# EAGLE schematic 4-up (EAGLE 9.5.2)
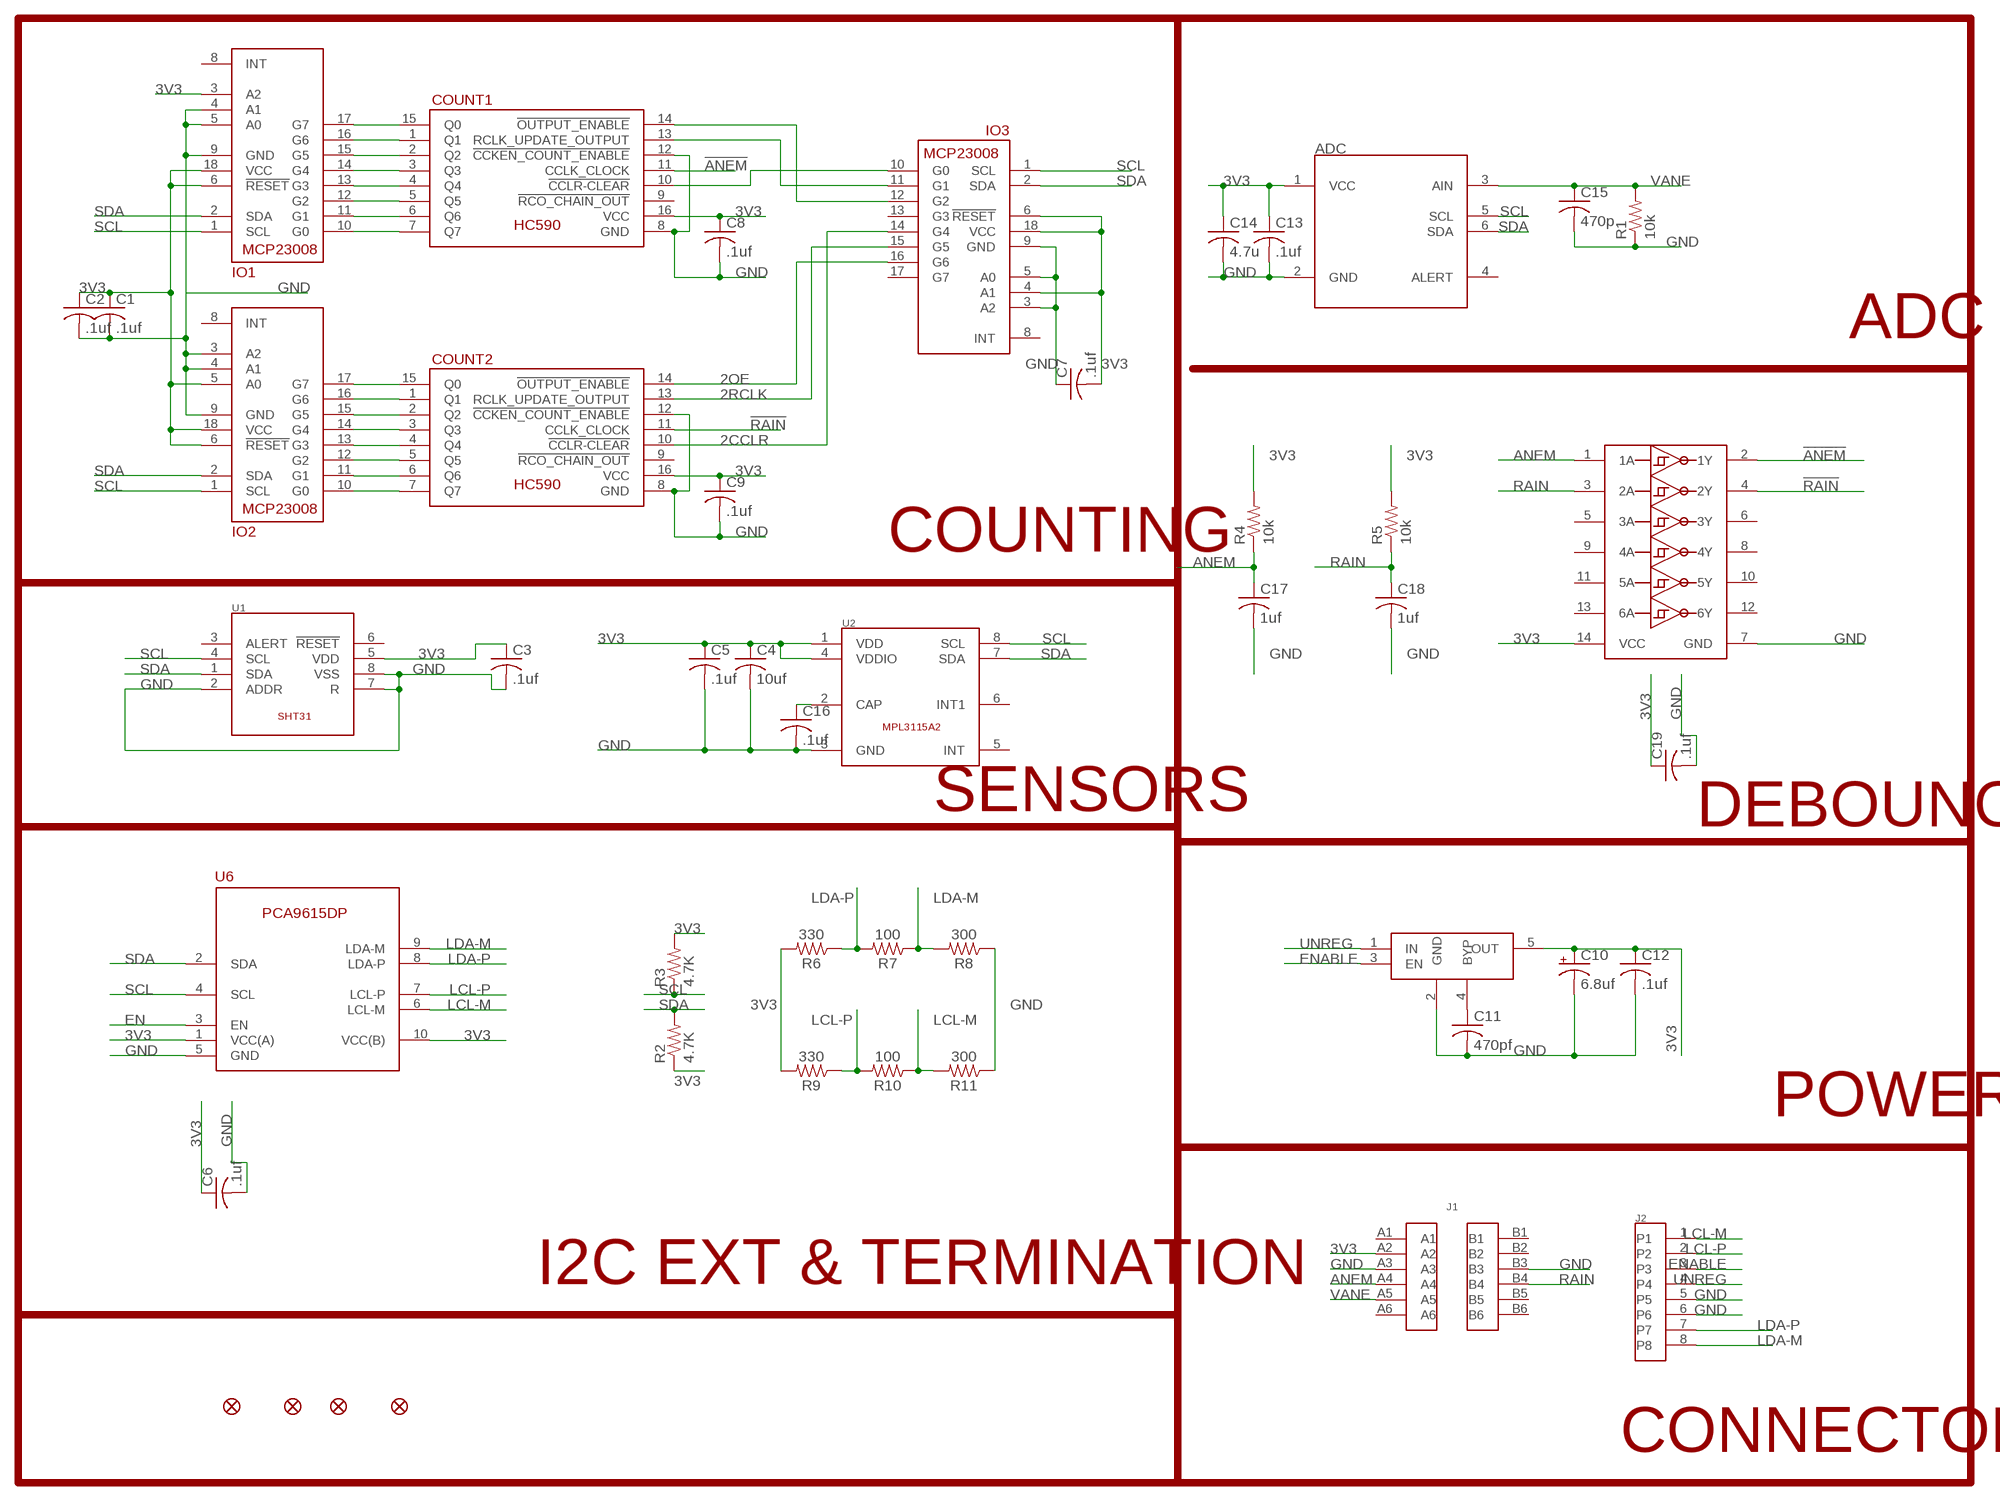
[diagram p0: schematic, sheet 1]

## Parts
ADC  ADC081C021SOT-DDC  [SOP95P280X110-6]
C1  .1uf  C-USC0603K  [C0603K]
C2  .1uf  C-USC0603K  [C0603K]
C3  .1uf  C-USC0603K  [C0603K]
C4  10uf  C-USC0603K  [C0603K]
C5  .1uf  C-USC0603K  [C0603K]
C6  .1uf  C-USC0603K  [C0603K]
C7  .1uf  C-USC0603K  [C0603K]
C8  .1uf  C-USC0603K  [C0603K]
C9  .1uf  C-USC0603K  [C0603K]
C10  6.8uf  CPOL-USA/3216-18R  [A/3216-18R]
C11  470pf  C-USC0603K  [C0603K]
C12  .1uf  C-USC0603K  [C0603K]
C13  .1uf  C-USC0603K  [C0603K]
C14  4.7u  C-USC0603K  [C0603K]
C15  470p  C-USC0603K  [C0603K]
C16  .1uf  C-USC0603K  [C0603K]
C17  1uf  C-USC0603K  [C0603K]
C18  1uf  C-USC0603K  [C0603K]
C19  .1uf  C-USC0603K  [C0603K]
COUNT1  74HC590  [SOIC127P1050X265-16]
COUNT2  74HC590  [SOIC127P1050X265-16]
FID1  FIDUCIAL1X2.5  [FIDUCIAL-1X2.5]
FID2  FIDUCIAL1X2.5  [FIDUCIAL-1X2.5]
FID3  FIDUCIAL1X2.5  [FIDUCIAL-1X2.5]
FID4  FIDUCIAL1X2.5  [FIDUCIAL-1X2.5]
INVERTER  74HC14  [SOIC127P780X200-14]
IO1  MCP23008  [SOIC18-W]
IO2  MCP23008  [SOIC18-W]
IO3  MCP23008  [SOIC18-W]
J1  43841-0005  [43841-0005]
J2  95501-6889  [95501-6889]
R1  10k  R-US_R0603  [R0603]
R2  4.7K  R-US_R0603  [R0603]
R3  4.7K  R-US_R0603  [R0603]
R4  10k  R-US_R0603  [R0603]
R5  10k  R-US_R0603  [R0603]
R6  330  100KOHM-0603-1/10W-1%  [0603]
R7  100  100KOHM-0603-1/10W-1%  [0603]
R8  300  100KOHM-0603-1/10W-1%  [0603]
R9  330  100KOHM-0603-1/10W-1%  [0603]
R10  100  100KOHM-0603-1/10W-1%  [0603]
R11  300  100KOHM-0603-1/10W-1%  [0603]
U1  SHT31  [SON50P240X240X80-9T80]
U2  MPL3115A2LGA8  [SON125P300X500X110-8]
U5  MIC5219-3.3YM5-TR  [SOT95P280X145-5]
U6  PCA9615  [SOP50P490X110-10]

## Nets
2CCLR: COUNT2.10(!CCLR-CLEAR) IO3.14(G4)
2OE: COUNT2.14(!OUTPUT_ENABLE) IO3.16(G6)
2RCLK: COUNT2.13(RCLK_UPDATE_OUTPUT) IO3.15(G5)
3V3: ADC.1(VCC) C1.1 C2.1 C3.1 C4.1 C5.1 C6.1 C7.2 C8.1 C9.1 C10.+ C12.1 C13.1 C14.1 C19.1 COUNT1.16(VCC) COUNT2.16(VCC) INVERTER.14(VCC) IO1.3(A2) IO1.6(!RESET) IO1.18(VCC) IO2.5(A0) IO2.6(!RESET) IO2.18(VCC) IO3.4(A1) IO3.6(!RESET) IO3.18(VCC) J1.A2 R2.1 R3.2 R4.2 R5.2 R6.2 R9.2 U1.5(VDD) U2.1(VDD) U2.4(VDDIO) U5.5(OUT) U6.1(VCC(A)) U6.10(VCC(B))
!ANEM: COUNT1.11(CCLK_CLOCK) INVERTER.2(1Y)
!RAIN: COUNT2.11(CCLK_CLOCK) INVERTER.4(2Y)
ANEM: C17.1 INVERTER.1(1A) J1.A4 R4.1
CAP: C16.1 U2.2(CAP)
EN: U6.3(EN)
ENABLE: J2.3 U5.3(EN)
GND: ADC.2(GND) C1.2 C2.2 C3.2 C4.2 C5.2 C6.2 C7.1 C8.2 C9.2 C10.- C11.2 C12.2 C13.2 C14.2 C15.2 C16.2 C17.2 C18.2 C19.2 COUNT1.8(GND) COUNT1.12(!CCKEN_COUNT_ENABLE) COUNT2.8(GND) COUNT2.12(!CCKEN_COUNT_ENABLE) INVERTER.7(GND) IO1.4(A1) IO1.5(A0) IO1.9(GND) IO2.3(A2) IO2.4(A1) IO2.9(GND) IO3.3(A2) IO3.5(A0) IO3.9(GND) J1.A3 J1.B3 J2.5 J2.6 R1.1 R8.1 R11.1 U1.2(ADDR) U1.7(R) U1.8(VSS) U2.3(GND) U5.2(GND) U6.5(GND)
LCL-M: J2.1 R10.1 R11.2 U6.6(LCL-M)
LCL-P: J2.2 R9.1 R10.2 U6.7(LCL-P)
LDA-M: J2.8 R7.1 R8.2 U6.9(LDA-M)
LDA-P: J2.7 R6.1 R7.2 U6.8(LDA-P)
N$1: COUNT2.15(Q0) IO2.17(G7)
N$2: COUNT2.1(Q1) IO2.16(G6)
N$3: COUNT2.2(Q2) IO2.15(G5)
N$4: COUNT2.3(Q3) IO2.14(G4)
N$5: COUNT2.4(Q4) IO2.13(G3)
N$6: COUNT2.5(Q5) IO2.12(G2)
N$7: COUNT2.6(Q6) IO2.11(G1)
N$8: COUNT2.7(Q7) IO2.10(G0)
N$9: COUNT1.15(Q0) IO1.17(G7)
N$10: COUNT1.1(Q1) IO1.16(G6)
N$12: COUNT1.2(Q2) IO1.15(G5)
N$13: COUNT1.3(Q3) IO1.14(G4)
N$14: COUNT1.4(Q4) IO1.13(G3)
N$15: COUNT1.5(Q5) IO1.12(G2)
N$16: COUNT1.6(Q6) IO1.11(G1)
N$17: COUNT1.7(Q7) IO1.10(G0)
N$18: COUNT1.14(!OUTPUT_ENABLE) IO3.12(G2)
N$19: COUNT1.13(RCLK_UPDATE_OUTPUT) IO3.11(G1)
N$20: COUNT1.10(!CCLR-CLEAR) IO3.10(G0)
N$23: C11.1 U5.4(BYP)
RAIN: C18.1 INVERTER.3(2A) J1.B4 R5.1
SCL: ADC.5(SCL) IO1.1(SCL) IO2.1(SCL) IO3.1(SCL) R3.1 U1.4(SCL) U2.8(SCL) U6.4(SCL)
SDA: ADC.6(SDA) IO1.2(SDA) IO2.2(SDA) IO3.2(SDA) R2.2 U1.1(SDA) U2.7(SDA) U6.2(SDA)
UNREG: J2.4 U5.1(IN)
VANE: ADC.3(AIN) C15.1 J1.A5 R1.2
Unconnected: ADC.4(ALERT) COUNT1.9(!RCO_CHAIN_OUT) COUNT2.9(!RCO_CHAIN_OUT) INVERTER.5(3A) INVERTER.6(3Y) INVERTER.8(4Y) INVERTER.9(4A) INVERTER.10(5Y) INVERTER.11(5A) INVERTER.12(6Y) INVERTER.13(6A) IO1.8(INT) IO2.8(INT) IO3.8(INT) IO3.13(G3) IO3.17(G7) J1.A1 J1.A6 J1.B1 J1.B2 J1.B5 J1.B6 U1.3(ALERT) U1.6(!RESET) U2.5(INT) U2.6(INT1)

## Notes on the sheet
- ADC
- COUNTING
- SENSORS | DEBOUNCE
- POWER
- I2C EXT & TERMINATION
- CONNECTORS

## Library data of the parts
ADC = Conservify:ADC081C021: 8-Bit ADC with Altert
C1-C9 C11-C19 = rcl:C-US: CAPACITOR, American symbol; SPICEPREFIX: C
C10 = rcl:CPOL-US: POLARIZED CAPACITOR, American symbol; SPICEPREFIX: C
COUNT1 COUNT2 = Conservify:74HC590
FID1-FID4 = microbuilder:FIDUCIAL: Fiducial Alignment Points Various fiducial points for machine vision alignment.; BOM: EXCLUDE
INVERTER = Conservify:74HC14
IO1-IO3 = Conservify:MCP23008
J1 = Conservify:43841-0005
J2 = Conservify:95501-6889: Molex RJ-45 Connector
R1-R5 = rcl:R-US_: RESISTOR, American symbol; SPICEPREFIX: R
R6-R11 = SparkFun-Resistors:100KOHM: 100kΩ resistor A resistor is a passive two-terminal electrical component that implements electrical resistance as a circuit element. Resistors act to reduce current flow, and, at the same time, act to lower voltage levels within circuits. - Wikipedia; PROD_ID: RES-07828; VALUE: 100k
U1 = Conservify:SHT31: SHT3x-DIS Humidity and Temperature Sensor
U2 = Conservify:MPL3115A2: MPL3115A2 Precision pressure sensor with altimetry.
U5 = Conservify:MIC5219-3.3YM5-TR
U6 = Conservify:PCA9615